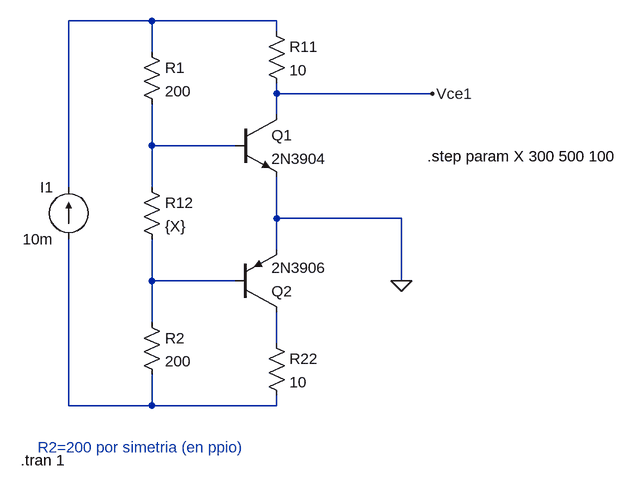
[diagram p0: schematic multipl_vbe.asc]
multipl_vbe.asc, the LTspice schematic file:
Version 4
SHEET 1 880 708
WIRE 112 16 -16 16
WIRE 304 16 112 16
WIRE 304 32 304 16
WIRE 112 64 112 16
WIRE 304 128 304 112
WIRE 544 128 304 128
WIRE 304 160 304 128
WIRE 112 208 112 144
WIRE 240 208 112 208
WIRE -16 272 -16 16
WIRE 112 272 112 208
WIRE 304 320 304 256
WIRE 496 320 304 320
WIRE 304 368 304 320
WIRE 112 416 112 352
WIRE 240 416 112 416
WIRE 496 416 496 320
WIRE 112 480 112 416
WIRE 304 512 304 464
WIRE -16 608 -16 352
WIRE 112 608 112 560
WIRE 112 608 -16 608
WIRE 304 608 304 592
WIRE 304 608 112 608
FLAG 496 416 0
FLAG 544 128 Vce1
SYMBOL res 96 48 R0
SYMATTR InstName R1
SYMATTR Value 200
SYMBOL res 96 464 R0
SYMATTR InstName R2
SYMATTR Value 200
SYMBOL res 96 256 R0
SYMATTR InstName R12
SYMATTR Value {X}
SYMBOL res 288 16 R0
SYMATTR InstName R11
SYMATTR Value 10
SYMBOL res 288 496 R0
SYMATTR InstName R22
SYMATTR Value 10
SYMBOL npn 240 160 R0
SYMATTR InstName Q1
SYMATTR Value 2N3904
SYMBOL pnp 240 464 M180
SYMATTR InstName Q2
SYMATTR Value 2N3906
SYMBOL current -16 352 R180
WINDOW 0 24 80 Left 2
WINDOW 3 24 0 Left 2
WINDOW 123 0 0 Left 0
WINDOW 39 0 0 Left 0
SYMATTR InstName I1
SYMATTR Value 10m
TEXT -64 672 Left 2 ;R2=200 por simetria (en ppio)
TEXT -90 692 Left 2 !.tran 1
TEXT 536 224 Left 2 !.step param X 300 500 100

The netlist it stands for:
* multipl_vbe.asc
R1 N001 N002 200
R2 N003 N005 200
R12 N002 N003 {X}
R11 N001 Vce1 10
R22 N004 N005 10
Q1 Vce1 N002 0 0 2N3904
Q2 N004 N003 0 0 2N3906
I1 N005 N001 10m
.model NPN NPN
.model PNP PNP
.lib standard.bjt
* R2=200 por simetria (en ppio)
.tran 1
.step param X 300 500 100
.backanno
.end